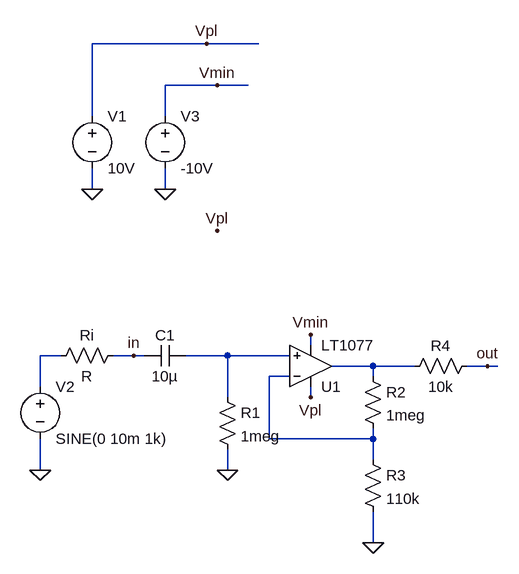
[diagram p0: schematic rauschen_opamp.asc]
rauschen_opamp.asc, the LTspice schematic file:
Version 4
SHEET 1 880 680
WIRE -16 -288 -192 -288
WIRE 64 -288 -16 -288
WIRE 0 -224 -80 -224
WIRE 48 -224 0 -224
WIRE -192 -176 -192 -288
WIRE -80 -176 -80 -224
WIRE -192 -64 -192 -96
WIRE -80 -64 -80 -96
WIRE 144 176 144 160
WIRE -240 192 -272 192
WIRE -128 192 -160 192
WIRE -112 192 -128 192
WIRE 16 192 -48 192
WIRE 112 192 16 192
WIRE 240 208 176 208
WIRE 304 208 240 208
WIRE 416 208 384 208
WIRE 432 208 416 208
WIRE 112 224 80 224
WIRE 240 224 240 208
WIRE -272 240 -272 192
WIRE 16 256 16 192
WIRE 144 256 144 240
WIRE 80 320 80 224
WIRE 240 320 240 304
WIRE 240 320 80 320
WIRE 240 352 240 320
WIRE -272 368 -272 320
WIRE 16 368 16 336
WIRE 240 480 240 432
FLAG -272 368 0
FLAG -192 -64 0
FLAG 16 368 0
FLAG 240 480 0
FLAG 416 208 out
FLAG -128 192 in
FLAG -80 -64 0
FLAG 0 -224 Vmin
FLAG -16 -288 Vpl
FLAG 144 160 Vmin
FLAG 144 256 Vpl
FLAG 0 0 Vpl
SYMBOL Opamps\\LT1077 144 272 M180
SYMATTR InstName U1
SYMBOL res -144 176 R90
WINDOW 0 0 56 VBottom 2
WINDOW 3 32 56 VTop 2
SYMATTR InstName Ri
SYMBOL res 224 208 R0
SYMATTR InstName R2
SYMATTR Value 1meg
SYMBOL res 224 336 R0
SYMATTR InstName R3
SYMATTR Value 110k
SYMBOL res 400 192 R90
WINDOW 0 0 56 VBottom 2
WINDOW 3 32 56 VTop 2
SYMATTR InstName R4
SYMATTR Value 10k
SYMBOL cap -48 176 R90
WINDOW 0 0 32 VBottom 2
WINDOW 3 32 32 VTop 2
SYMATTR InstName C1
SYMATTR Value 10µ
SYMBOL res 0 240 R0
SYMATTR InstName R1
SYMATTR Value 1meg
SYMBOL voltage -192 -192 R0
SYMATTR InstName V1
SYMATTR Value 10V
SYMBOL voltage -272 224 R0
WINDOW 123 0 0 Left 2
WINDOW 39 0 0 Left 2
SYMATTR InstName V2
SYMATTR Value SINE(0 10m 1k)
SYMBOL voltage -80 -192 R0
SYMATTR InstName V3
SYMATTR Value -10V

The netlist it stands for:
* rauschen_opamp.asc
XU1 N002 N004 Vpl Vmin N003 LT1077  ; pins In+ In- V+ V- OUT
Ri in N001 R
R2 N003 N004 1meg
R3 N004 0 110k
R4 out N003 10k
C1 N002 in 10µ
R1 N002 0 1meg
V1 Vpl 0 10V
V2 N001 0 SINE(0 10m 1k)
V3 Vmin 0 -10V
.backanno
.end